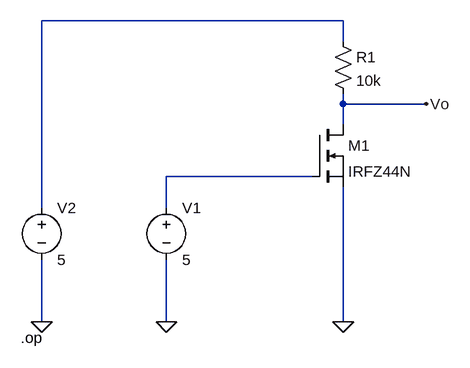
[diagram p0: schematic nmos.asc]
nmos.asc, the LTspice schematic file:
Version 4
SHEET 1 880 680
WIRE 224 -32 -240 -32
WIRE 224 0 224 -32
WIRE 224 96 224 80
WIRE 352 96 224 96
WIRE 224 128 224 96
WIRE 176 208 -48 208
WIRE -240 256 -240 -32
WIRE -48 256 -48 208
WIRE -240 432 -240 336
WIRE -48 432 -48 336
WIRE 224 432 224 224
FLAG 352 96 Vo
FLAG 224 432 0
FLAG -48 432 0
FLAG -240 432 0
SYMBOL nmos 176 128 R0
SYMATTR InstName M1
SYMATTR Value IRFZ44N
SYMBOL res 208 -16 R0
SYMATTR InstName R1
SYMATTR Value 10k
SYMBOL voltage -48 240 R0
WINDOW 123 0 0 Left 0
WINDOW 39 0 0 Left 0
SYMATTR InstName V1
SYMATTR Value 5
SYMBOL voltage -240 240 R0
WINDOW 123 0 0 Left 0
WINDOW 39 0 0 Left 0
SYMATTR InstName V2
SYMATTR Value 5
TEXT -272 456 Left 2 !.op

The netlist it stands for:
* nmos.asc
M1 Vo N002 0 0 IRFZ44N
R1 N001 Vo 10k
V1 N002 0 5
V2 N001 0 5
.model NMOS NMOS
.model PMOS PMOS
.lib standard.mos
.op
.backanno
.end